# EAGLE design Johnny 5 (EAGLE 8.7.1)
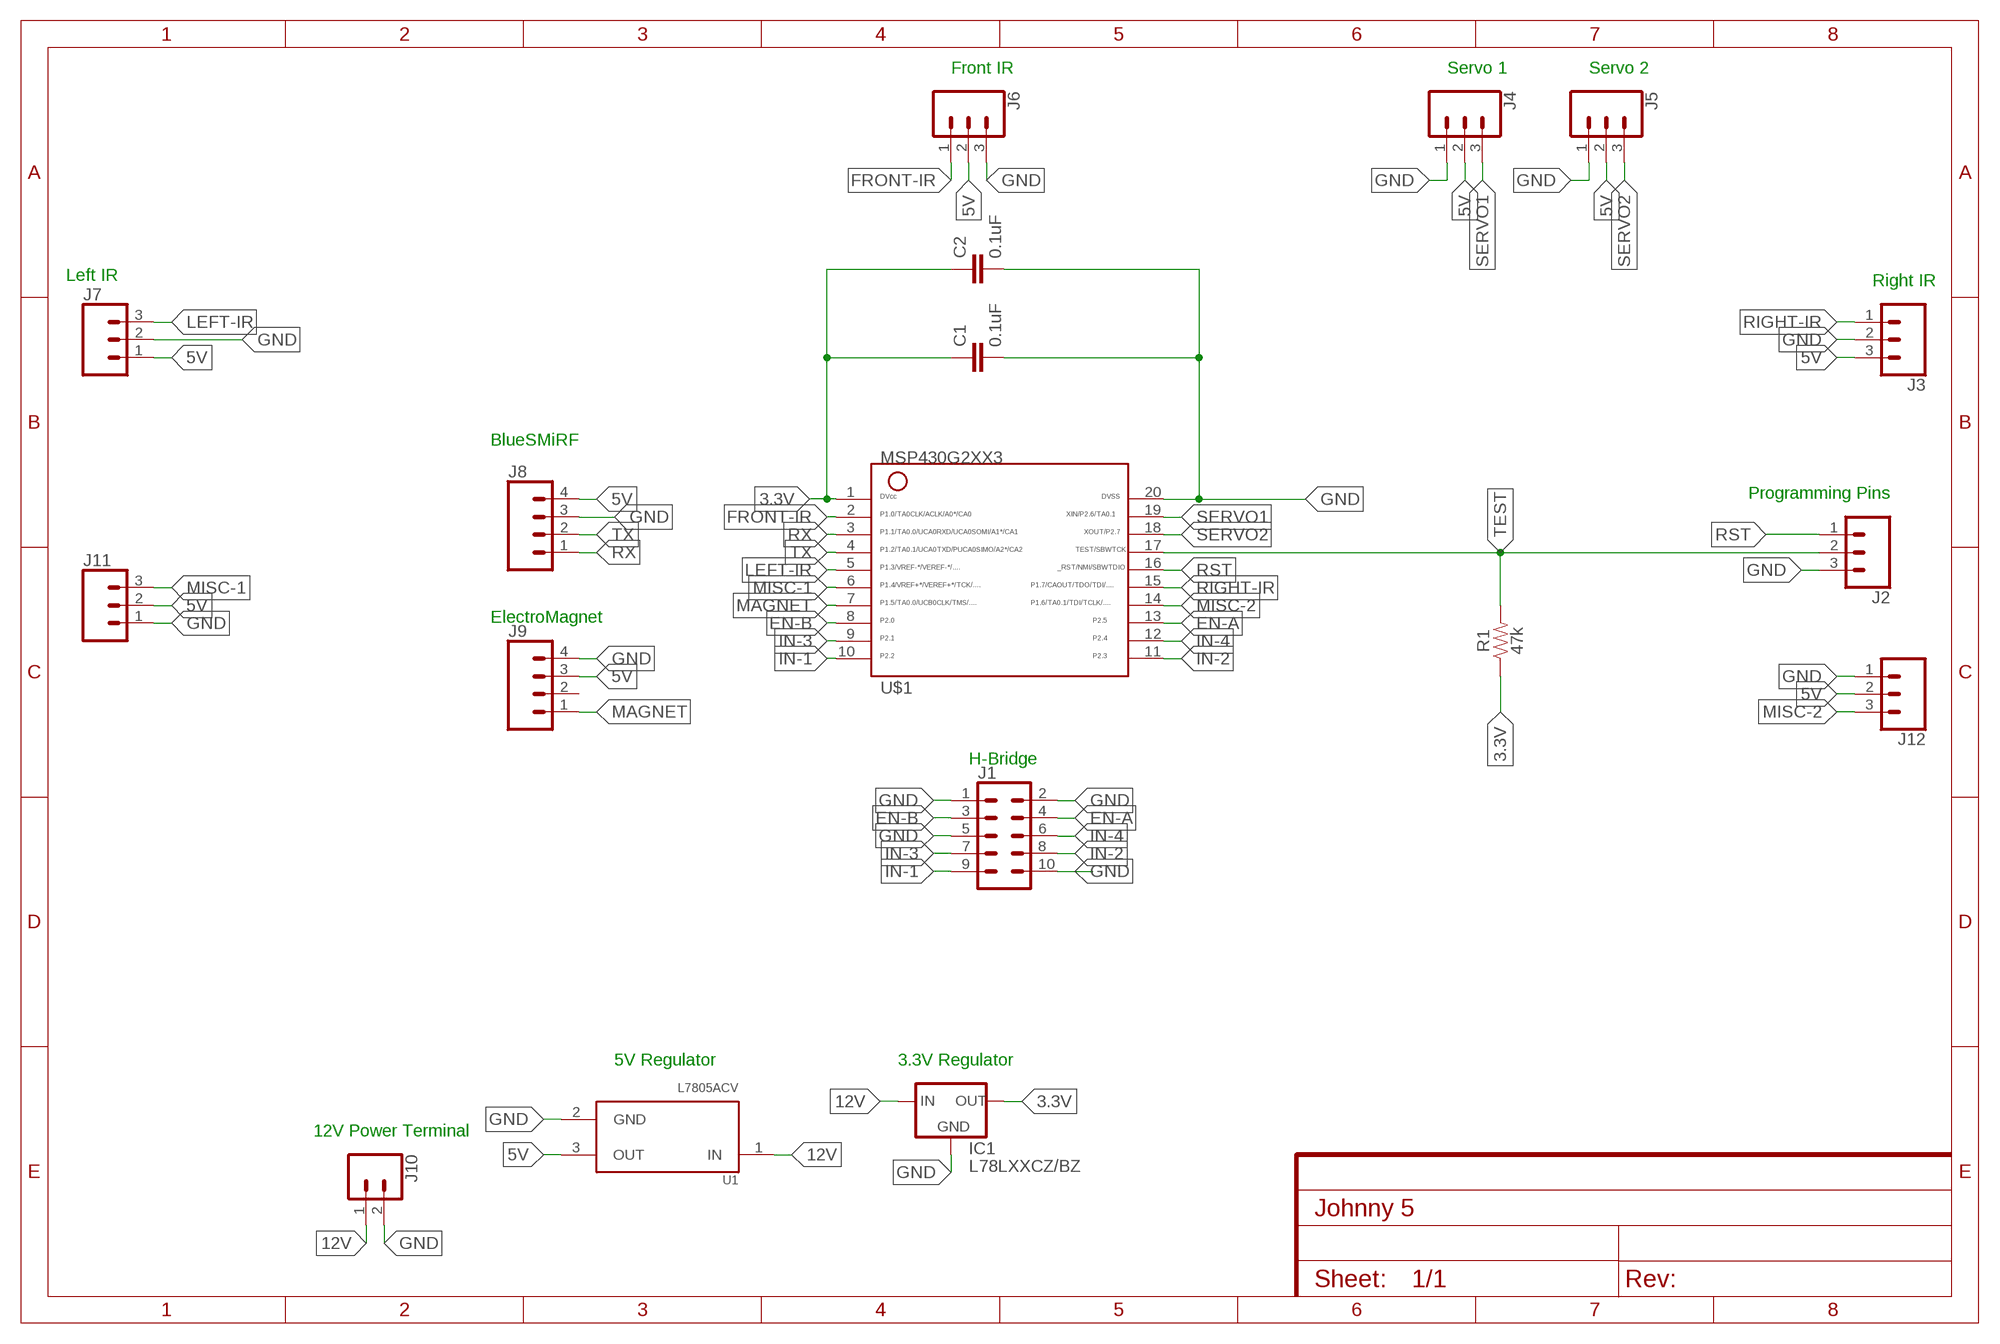
[diagram p0: schematic, sheet 1]

## Parts
C1  0.1uF  0.1UF-KIT-EZ-50V-20%  [CAP-PTH-SMALL-KIT]
C2  0.1uF  0.1UF-KIT-EZ-50V-20%  [CAP-PTH-SMALL-KIT]
IC1  L78LXXCZ/BZ  [TO92]
J1  CONN_05X2SHD  [2X5-SHROUDED]
J2  CONN_03  [1X03]
J3  CONN_03  [1X03]
J4  CONN_03  [1X03]
J5  CONN_03  [1X03]
J6  CONN_03  [1X03]
J7  CONN_03  [1X03]
J8  CONN_04  [1X04]
J9  CONN_04  [1X04]
J10  CONN_025MM  [SCREWTERMINAL-5MM-2]
J11  CONN_03  [1X03]
J12  CONN_03  [1X03]
R1  47k  47KOHM-0603-1/10W-1%  [0603]
U1  L7805ACV  [TO254P460X1020X1945-3P]
U$1  G2XX3---N20  [N20]

## Nets
3.3V: C1.1 C2.1 IC1.1(OUT) R1.1 U$1.1
5V: J3.3 J4.2 J5.2 J6.2 J7.1 J8.4 J9.3 J11.2 J12.2 U1.3(OUT)
12V: IC1.3(IN) J10.1 U1.1(IN)
EN-A: J1.4 U$1.13
EN-B: J1.3 U$1.8
FRONT-IR: J6.1 U$1.2
GND: C1.2 C2.2 IC1.2(GND) J1.1 J1.2 J1.5 J1.10 J2.3 J3.2 J4.1 J5.1 J6.3 J7.2 J8.3 J9.4 J10.2 J11.1 J12.1 U1.2(GND) U$1.20
IN-1: J1.9 U$1.10
IN-2: J1.8 U$1.11
IN-3: J1.7 U$1.9
IN-4: J1.6 U$1.12
LEFT-IR: J7.3 U$1.5
MAGNET: J9.1 U$1.7
MISC-1: J11.3 U$1.6
MISC-2: J12.3 U$1.14
RIGHT-IR: J3.1 U$1.15
RST: J2.1 U$1.16
RX: J8.1 U$1.3
SERVO1: J4.3 U$1.19
SERVO2: J5.3 U$1.18
TEST: J2.2 R1.2 U$1.17
TX: J8.2 U$1.4
Unconnected: J9.2

## Notes on the sheet
- Front IR | Servo 1 | Servo 2
- Left IR
- Right IR
- BlueSMiRF
- Programming Pins
- ElectroMagnet
- H-Bridge
- 5V Regulator | 3.3V Regulator
- 12V Power Terminal

## Library data of the parts
C1 C2 = SparkFun-Capacitors:0.1UF: 0.1µF ceramic capacitors A capacitor is a passive two-terminal electrical component used to store electrical energy temporarily in an electric field.; PROD_ID: CAP-08370
IC1 = v-reg:L78LXXCZ/BZ: VOLTAGE REGULATOR
J1 = SparkFun-Connectors:CONN_05X2: Multi connection point. Often used as Generic Header-pin footprint for 0.1 inch spaced/style header connections For AVR SPI programming port, see special device with nice symbol: "AVR_SPI_PROG_5x2.dev" You can populate with any combo of single row headers, but if you'd like an exact match, check these: 2x5 AVR ICSP Male Header <https://www.sparkfun.com/products/778> (PRT-00778) 2x5 Pin Shrouded Header <https://www.sparkfun.com/products/8506> (PRT-08506) On any of the 0.1 inch spaced packages, you can populate with these: Break Away Headers - Straight <https://www.sparkfun.com/products/116> (PRT-00116) Break Away Male Headers - Right Angle <https://www.sparkfun.com/products/553> (PRT-00553) Female Headers <https://www.sparkfun.com/products/115> (PRT-00115) Break Away Headers - Machine Pin <https://www.sparkfun.com/products/117> (PRT-00117) Break Away Female Headers - Swiss Machine Pin <https://www.sparkfun.com/products/743> (PRT-00743) Special note: the shrouded connector mates well with our 5x2 ribbon cables: 2x5 Pin IDC Ribbon Cable <https://www.sparkfun.com/products/8535> (PRT-08535); PROD_ID: CONN-08671; SF_ID: PRT-08506
J2-J7 J11 J12 = SparkFun-Connectors:CONN_03: Multi connection point. Often used as Generic Header-pin footprint for 0.1 inch spaced/style header connections On any of the 0.1 inch spaced packages, you can populate with these: Break Away Headers - Straight <https://www.sparkfun.com/products/116> (PRT-00116) Break Away Male Headers - Right Angle <https://www.sparkfun.com/products/553> (PRT-00553) Female Headers <https://www.sparkfun.com/products/115> (PRT-00115) Break Away Headers - Machine Pin <https://www.sparkfun.com/products/117> (PRT-00117) Break Away Female Headers - Swiss Machine Pin <https://www.sparkfun.com/products/743> (PRT-00743) Stackable Header - 3 Pin (Female, 0.1") <https://www.sparkfun.com/products/13875> (PRT-13875) For SCREWTERMINALS and SPRING TERMINALS visit here: Screw Terimnals on SparkFun.com <https://www.sparkfun.com/search/results?term=Screw+Terminals> (5mm/3.5mm/2.54mm spacing) This device is also useful as a general connection point to wire up your design to another part of your project. Our various solder wires solder well into these plated through hole pads. Hook-Up Wire - Assortment (Stranded, 22 AWG) <https://www.sparkfun.com/products/11375> (PRT-11375) Hook-Up Wire - Assortment (Solid Core, 22 AWG) <https://www.sparkfun.com/products/11367> (PRT-11367) View the entire wire category on our website here <https://www.sparkfun.com/categories/141> Special notes: Molex polarized connector foot print use with SKU : PRT-08232 with associated crimp pins and housings.
J8 J9 = SparkFun-Connectors:CONN_04: Multi connection point. Often used as Generic Header-pin footprint for 0.1 inch spaced/style header connections On any of the 0.1 inch spaced packages, you can populate with these: Break Away Headers - Straight <https://www.sparkfun.com/products/116> (PRT-00116) Break Away Male Headers - Right Angle <https://www.sparkfun.com/products/553> (PRT-00553) Female Headers <https://www.sparkfun.com/products/115> (PRT-00115) Break Away Headers - Machine Pin <https://www.sparkfun.com/products/117> (PRT-00117) Break Away Female Headers - Swiss Machine Pin <https://www.sparkfun.com/products/743> (PRT-00743) For SCREWTERMINALS and SPRING TERMINALS visit here: Screw Terimnals on SparkFun.com <https://www.sparkfun.com/search/results?term=Screw+Terminals> (5mm/3.5mm/2.54mm spacing) This device is also useful as a general connection point to wire up your design to another part of your project. Our various solder wires solder well into these plated through hole pads. Hook-Up Wire - Assortment (Stranded, 22 AWG) <https://www.sparkfun.com/products/11375> (PRT-11375) Hook-Up Wire - Assortment (Solid Core, 22 AWG) <https://www.sparkfun.com/products/11367> (PRT-11367) View the entire wire category on our website here <https://www.sparkfun.com/categories/141> Special notes: Molex polarized connector foot print use with SKU : PRT-08231 with associated crimp pins and housings. 1MM SMD Version SKU: PRT-10208; PROD_ID: CONN-09696
J10 = SparkFun-Connectors:CONN_02: Multi connection point. Often used as Generic Header-pin footprint for 0.1 inch spaced/style header connections On any of the 0.1 inch spaced packages, you can populate with these: Break Away Headers - Straight <https://www.sparkfun.com/products/116> (PRT-00116) Break Away Male Headers - Right Angle <https://www.sparkfun.com/products/553> (PRT-00553) Female Headers <https://www.sparkfun.com/products/115> (PRT-00115) Break Away Headers - Machine Pin <https://www.sparkfun.com/products/117> (PRT-00117) Break Away Female Headers - Swiss Machine Pin <https://www.sparkfun.com/products/743> (PRT-00743) For SCREWTERMINALS and SPRING TERMINALS visit here: Screw Terimnals on SparkFun.com <https://www.sparkfun.com/search/results?term=Screw+Terminals> (5mm/3.5mm/2.54mm spacing) This device is also useful as a general connection point to wire up your design to another part of your project. Our various solder wires solder well into these plated through hole pads. Hook-Up Wire - Assortment (Stranded, 22 AWG) <https://www.sparkfun.com/products/11375> (PRT-11375) Hook-Up Wire - Assortment (Solid Core, 22 AWG) <https://www.sparkfun.com/products/11367> (PRT-11367) View the entire wire category on our website here <https://www.sparkfun.com/categories/141> Special notes: Molex polarized connector foot print use with: PRT-08233 with associated crimp pins and housings. 2.54_SCREWTERM for use with PRT-10571. 3.5mm Screw Terminal footprints for PRT-08084 5mm Screw Terminal footprints for use with PRT-08432; SF_SKU: PRT-08432
R1 = SparkFun-Resistors:47KOHM: 47kΩ resistor A resistor is a passive two-terminal electrical component that implements electrical resistance as a circuit element. Resistors act to reduce current flow, and, at the same time, act to lower voltage levels within circuits. - Wikipedia; PROD_ID: RES-07871
U1 = L7805ACV (1):L7805ACV: L7805 Series 1.5 A 5 V Three Terminal Voltage Regulator - TO-220; DESCRIPTION: IC REG LINEAR 5V 1.5A TO220AB; DIGI-KEY_PART_NUMBER: 497-1441-5-ND; DIGI-KEY_PURCHASE_URL: https://www.digikey.com/product-detail/en/stmicroelectronics/L7805ACV/497-1441-5-ND/585962?WT.z_cid=ref_snapeda&utm_source=snapeda&utm_medium=aggregator&utm_campaign=buynow; MF: STMicroelectronics; MP: L7805ACV; PACKAGE: TO-220 STMicroelectronics
U$1 = TI_MSP430_v16 schematic:G2XX3---N20: MSP430G2XX1 PDIP (N) 20 Pin Package

## Board
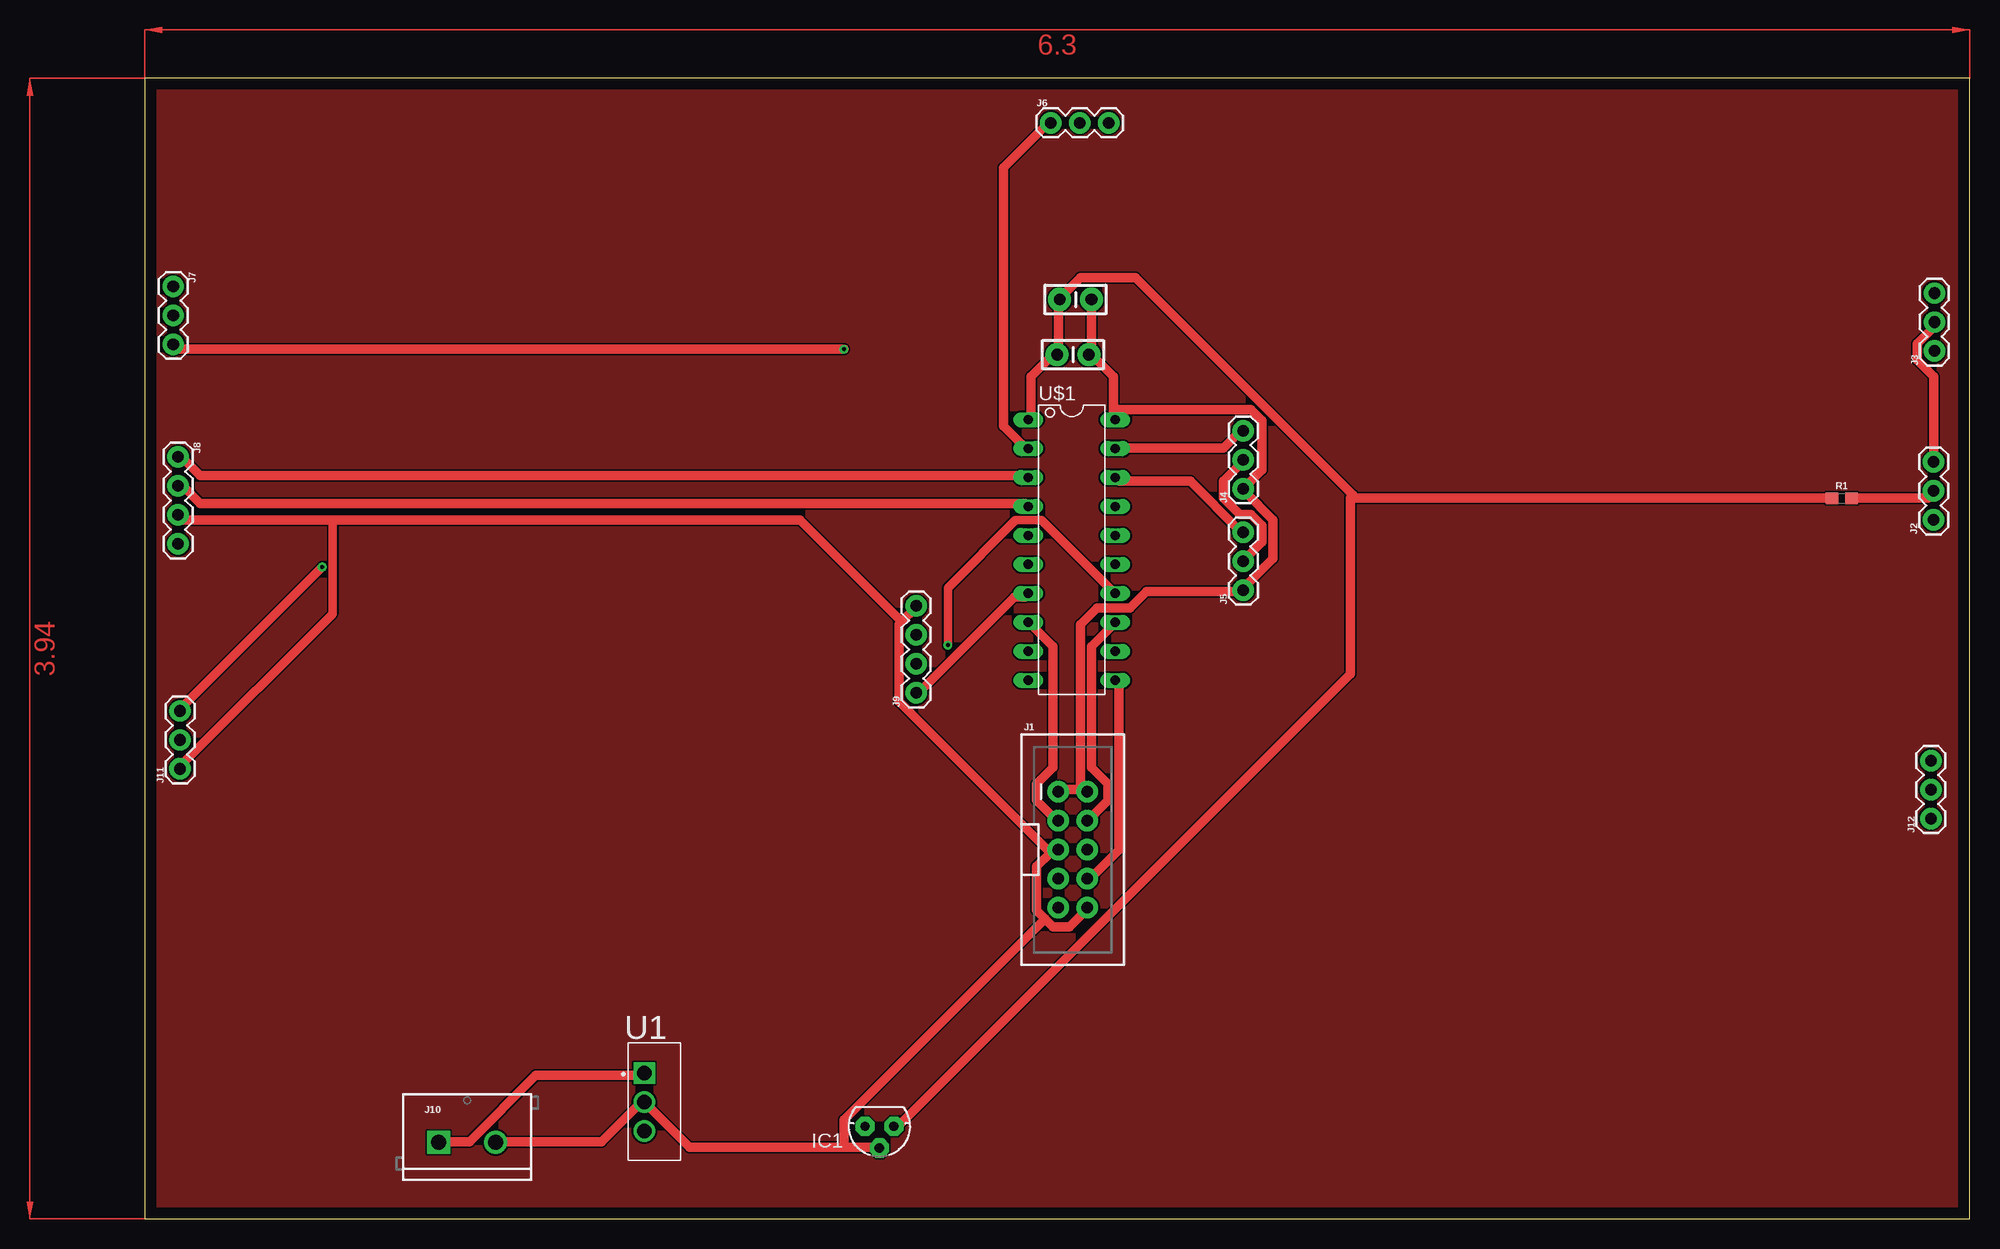
[diagram p1: board, top side]
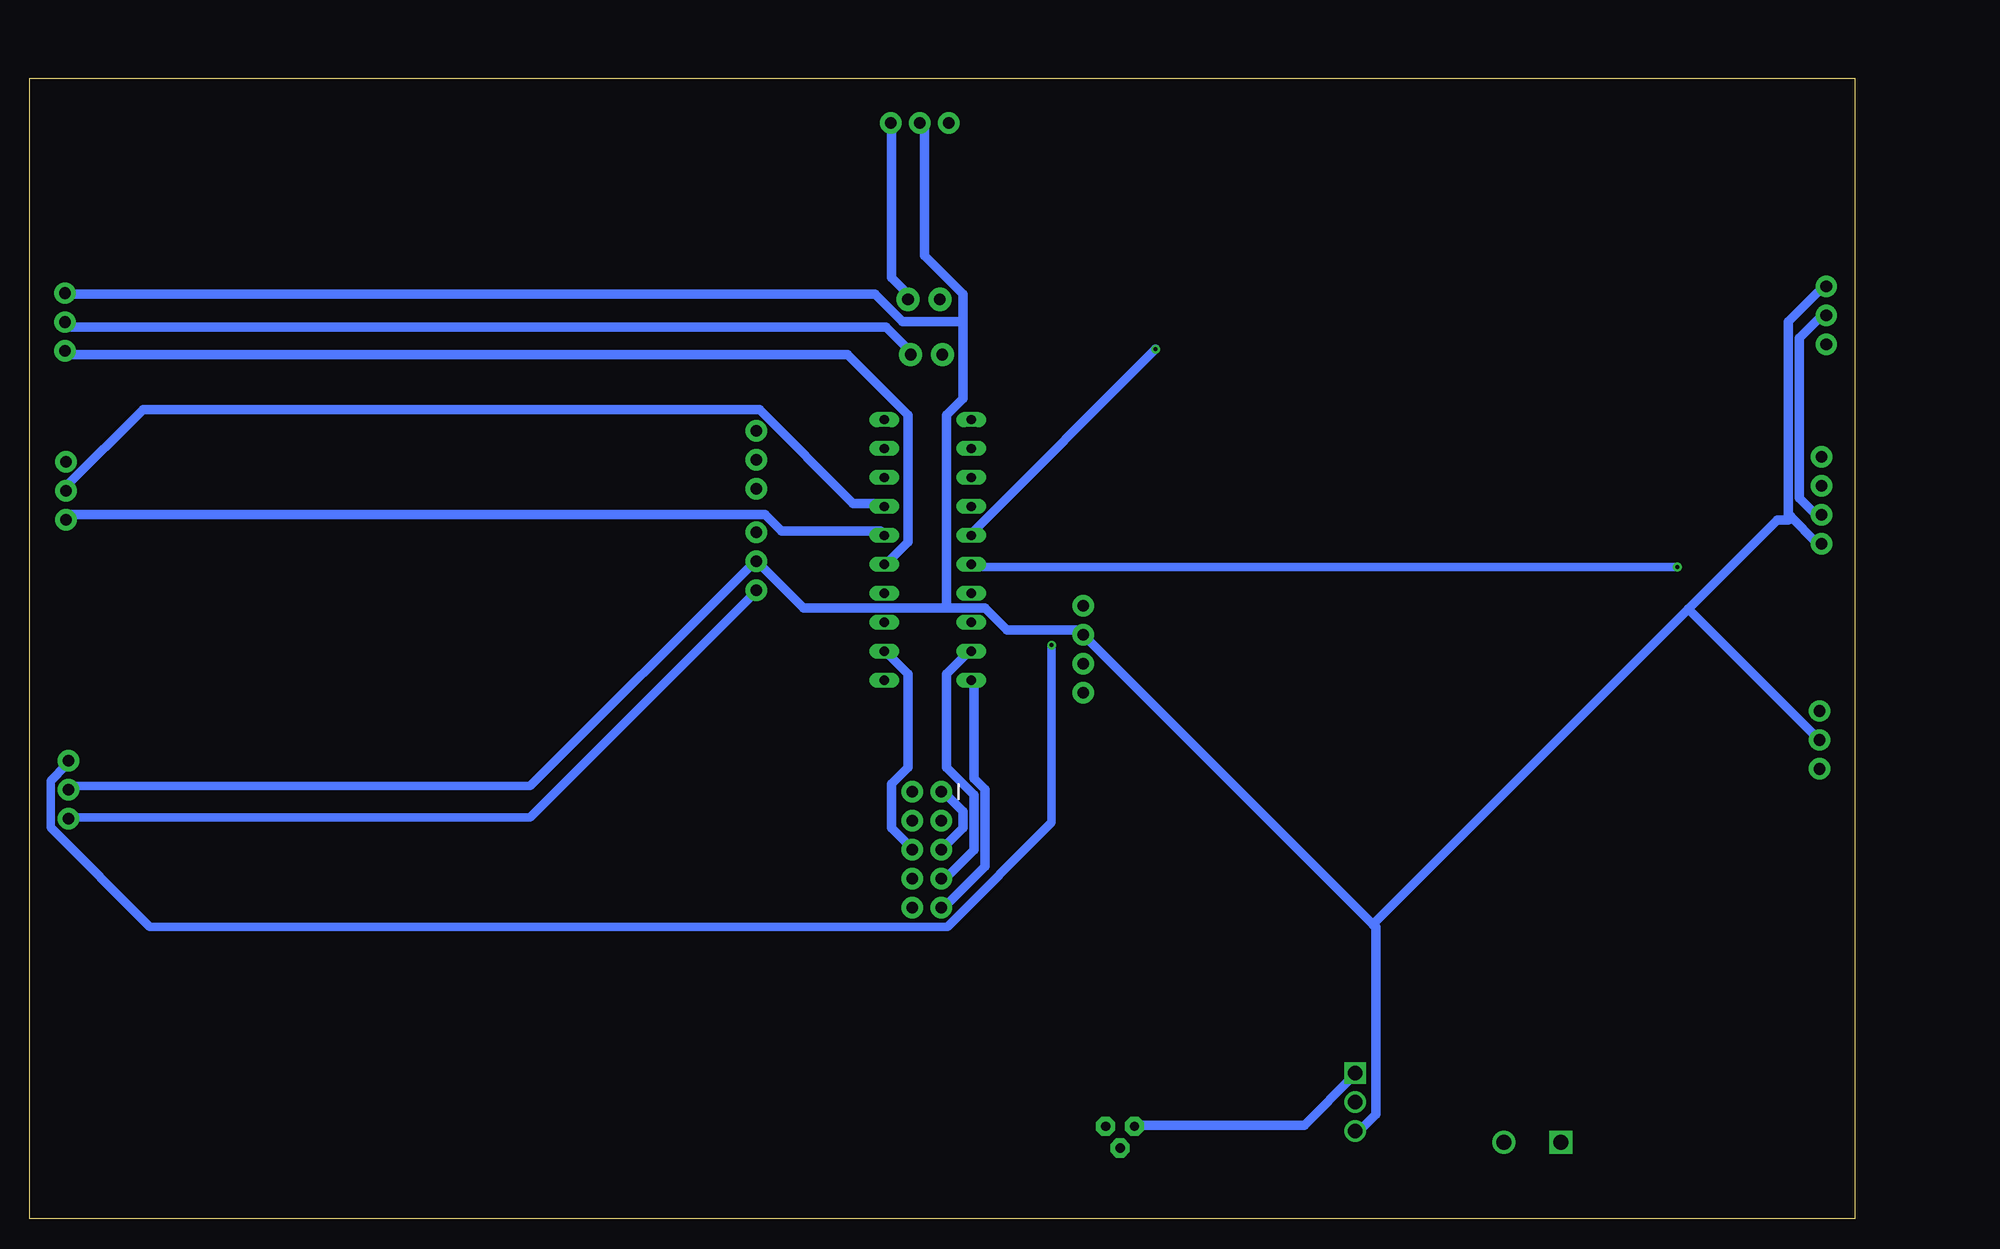
[diagram p2: board, bottom side, seen from below]

Size 160 x 100 mm. Coordinates in mm from the lower left corner, seen from the top.
Outline: 0,0 160,0 160,100 0,100 0,0
Copper layers (1*16): Top 0.035mm / dielectric 1.5mm / Bottom 0.035mm
Design rules "default *": minimum track width 30mil, minimum drill 0.35mm, track to track 6mil, track to pad 6mil, pad to pad 6mil, via to via 6mil, smd to smd 6mil, copper to edge 40mil, drill to drill 6mil, minimum pad ring 10mil, minimum via ring 8mil, stop-mask expansion 4mil, vias tented up to drill 0mil, thermal gap 10mil

### Footprints (pad centres in the part's own frame; a part is rotated, then mirrored left to right if it is on the bottom)
CAP-PTH-SMALL-KIT = drill 1.016 pad 2.032: 1 -1.397,0; 2 1.397,0
TO92 = drill 0.813 pad 1.676 octagon: 1 -1.27,0; 2 0,1.905; 3 1.27,0
2X5-SHROUDED = drill 1.016 pad 1.88: 1 -1.27,5.08; 2 1.27,5.08; 3 -1.27,2.54; 4 1.27,2.54; 5 -1.27,0; 6 1.27,0; 7 -1.27,-2.54; 8 1.27,-2.54; 9 -1.27,-5.08; 10 1.27,-5.08
1X03 = drill 1.016 pad 1.88: 1 0,0; 2 2.54,0; 3 5.08,0
1X04 = drill 1.016 pad 1.88: 1 0,0; 2 2.54,0; 3 5.08,0; 4 7.62,0
SCREWTERMINAL-5MM-2 = drill 1.3 pad 2.032 square: 1 0,0 | drill 1.3 pad 2.032: 2 5,0
0603 = smd 1.1 x 1: 1 -0.85,0; 2 0.85,0
TO254P460X1020X1945-3P = drill 1.27 pad 1.91 square: 1 0,2.54 | drill 1.27 pad 1.91: 2 0,0; 3 0,-2.54
N20 = drill 0.813 long: 1 -11.435,-3.81; 2 -8.895,-3.81; 3 -6.355,-3.81; 4 -3.815,-3.81; 5 -1.275,-3.81; 6 1.265,-3.81; 7 3.805,-3.81; 8 6.345,-3.81; 9 8.885,-3.81; 10 11.425,-3.81; 11 11.425,3.81; 12 8.885,3.81; 13 6.345,3.81; 14 3.805,3.81; 15 1.265,3.81; 16 -1.275,3.81; 17 -3.815,3.81; 18 -6.355,3.81; 19 -8.895,3.81; 20 -11.435,3.81

### Placement (x,y rotation side)
C1  81.61,80.62 0 top
C2  81.38,75.78 0 top
IC1  64.41,8.1 180 top
J1  81.37,32.37 0 top
J2  156.85,61.29 90 top
J3  156.93,76.09 90 top
J4  96.32,64.01 90 top
J5  96.32,55.12 90 top
J6  79.43,96.11 0 top
J7  2.48,81.76 270 top
J8  2.91,66.8 270 top
J9  67.62,46.12 90 top
J10  25.76,6.69 0 top
J11  3.08,39.44 90 top
J12  156.62,35.09 90 top
R1  148.8,63.18 0 top
U1  43.8,10.23 0 top
U$1  81.28,58.65 270 top

### Tracks (layer width: path | path; a pad name or v marks a point on that pad's centre or on a via)
3.3V
  Top 0.813: U$1.1 77.7,70.46 77.7,73.84 79.63,75.77 C2.1 80.11,76.25 80.11,80.59 C1.1 80.59,81.08 82.04,82.53 86.87,82.53 105.93,63.46 | 105.93,63.46 106.17,63.22 147.68,63.22 R1.1 | IC1.1 66.12,8.2 105.69,47.78 105.69,63.22 105.93,63.46
5V
  Top 0.813: J4.2 96.04,66.12 94.59,64.67 94.59,63.22 96.04,61.77 97,61.77 97.97,60.81 97.97,59.36 96.52,57.91 J5.2
  Bottom 0.762: J11.2 3.2,42.06 14.59,53.45 14.63,53.49 | J12.2 156.36,37.95 116.13,37.95 96.47,57.61 J5.2
  Bottom 0.813: 5.55,61.53 5.79,61.77 5.79,78.66 2.9,81.56 J7.1 | 5.55,61.53 3.38,59.36 J8.4 | 79.63,53.57 92.18,53.57 96.04,57.43 J5.2 | 79.63,53.57 76.25,53.57 74.32,51.64 68.05,51.64 J9.3 67.56,51.16 42.23,25.82 | 78.18,78.66 78.18,71.91 79.63,70.46 79.63,53.57 | 78.18,78.66 78.18,81.08 81.56,84.45 81.56,96.04 J6.2 | 78.18,78.66 83.49,78.66 85.9,81.08 156.84,81.08 J3.3 | 42.23,25.82 41.99,25.58 41.99,9.17 43.43,7.72 U1.3 | 42.23,25.82 14.59,53.45 6.76,61.29 5.79,61.29 5.55,61.53
12V
  Top 0.813: J10.1 26.06,6.76 28.47,6.76 34.27,12.55 43.43,12.55 U1.1
  Bottom 0.813: IC1.3 62.74,8.2 48.26,8.2 43.92,12.55 U1.1
EN-A
  Top 0.813: U$1.13 84.94,52.12 83.01,50.19 83.01,39.57 84.45,38.12 84.45,36.68 83.01,35.23 J1.4
EN-B
  Top 0.813: U$1.8 77.7,52.12 79.63,50.19 79.63,39.57 78.18,38.12 78.18,36.68 79.63,35.23 J1.3
FRONT-IR
  Top 0.813: U$1.2 77.22,67.56 75.29,69.49 75.29,92.18 79.15,96.04 J6.1
GND
  Top 0.762: 16.46,61.29 16.46,53.03 3.2,39.78 J11.1
  Top 0.813: J2.3 156.84,66.6 156.84,73.84 155.4,75.29 155.4,76.73 156.84,78.18 J3.2 | 84.94,70.94 84.94,73.84 83.01,75.77 C2.2 83.01,76.25 83.01,80.59 C1.2 | 84.94,70.94 84.94,70.46 U$1.20 | 84.94,70.94 97,70.94 97.97,69.98 97.97,65.63 96.52,64.19 J4.1 96.52,63.7 98.93,61.29 98.93,57.91 96.52,55.5 J5.1 96.04,55.02 87.83,55.02 86.39,53.57 83.49,53.57 82.04,52.12 82.04,37.64 | 61.29,6.27 47.78,6.27 43.92,10.13 U1.2 43.43,10.13 40.06,6.76 30.89,6.76 J10.2 | 61.29,6.27 64.19,6.27 IC1.2 | 82.04,37.64 82.53,37.64 J1.2 82.04,37.64 | 82.04,37.64 80.11,37.64 J1.1 | 78.91,26.3 78.18,27.03 78.18,30.89 79.39,32.09 | 78.91,26.3 79.63,25.58 81.08,25.58 82.53,27.03 J1.10 | 79.39,32.09 79.63,32.33 J1.5 | 66.36,52.36 66.12,52.12 66.12,45.36 79.39,32.09 | 66.36,52.36 67.56,53.57 J9.4 | 66.36,52.36 57.43,61.29 16.46,61.29 3.38,61.29 J8.3 | 61.29,6.27 61.29,8.69 78.91,26.3
  Bottom 0.762: J12.1 156.36,35.2 116.13,35.2 96.47,54.86 J5.1
  Bottom 0.813: J6.3 84.45,96.04 84.45,82.53 83.01,81.08 C1.2 | J3.2 156.84,78.18 84.94,78.18 83.01,76.25 C2.2 | J7.2 2.9,79.15 4.83,77.22 4.83,63.22 3.38,61.77 J8.3 | J1.1 79.63,37.16 78.18,35.71 78.18,34.27 79.63,32.82 J1.5
IN-1
  Bottom 0.813: U$1.10 77.22,46.81 77.22,38.61 76.25,37.64 76.25,30.89 79.63,27.51 J1.9
IN-2
  Top 0.813: U$1.11 85.42,46.81 85.42,32.33 83.01,29.92 J1.8
IN-3
  Bottom 0.813: U$1.9 77.7,49.71 79.63,47.78 79.63,39.57 77.22,37.16 77.22,32.33 79.63,29.92 J1.7
IN-4
  Bottom 0.813: U$1.12 84.94,49.71 83.01,47.78 83.01,39.57 84.45,38.12 84.45,34.27 83.01,32.82 J1.6
LEFT-IR  (via drill 0.35)
  Top 0.813: v61.29,76.25 2.9,76.25 J7.3
  Bottom 0.813: v61.29,76.25 77.22,60.33 U$1.5
MAGNET
  Top 0.813: U$1.7 77.22,54.53 76.25,54.53 68.05,46.33 J9.1
MISC-1  (via drill 0.35)
  Top 0.762: v15.54,57.15 3.2,44.81 J11.3
  Bottom 0.762: v15.54,57.15 77.27,57.15 U$1.6
MISC-2  (via drill 0.35)
  Top 0.762: v70.41,50.29 70.41,55.32 76.35,61.27 78.64,61.27 85.04,54.86 U$1.14
  Bottom 0.762: v70.41,50.29 70.41,34.75 79.55,25.6 149.5,25.6 158.19,34.29 158.19,38.41 156.82,39.78 J12.3
N$1
  pour Top: 0,100.1 160.7,100.1 160.7,-0.4 -0.27,-0.4 -0.27,100.22
RIGHT-IR
  Bottom 0.813: U$1.15 84.94,57.43 83.01,59.36 83.01,70.46 88.32,75.77 156.84,75.77 J3.1
RST
  Bottom 0.813: U$1.16 85.42,60.33 94.11,60.33 95.56,61.77 156.36,61.77 J2.1
RX
  Top 0.813: U$1.3 77.22,65.15 4.83,65.15 3.38,66.6 J8.1
SERVO1
  Top 0.813: U$1.19 85.42,67.56 94.59,67.56 96.04,69.01 J4.3
SERVO2
  Top 0.813: U$1.18 85.42,64.67 91.69,64.67 96.04,60.33 J5.3
TEST
  Top 0.813: R1.2 150.09,63.22 156.36,63.22 156.84,63.7 J2.2
  Bottom 0.813: U$1.17 85.42,62.74 87.83,62.74 96.04,70.94 150.09,70.94 156.84,64.19 J2.2
TX
  Top 0.813: U$1.4 77.22,62.74 4.83,62.74 3.38,64.19 J8.2
(copper drawn outside any net)
  shapes: Top area x2